# Altium schematic sheet ADC.SchDoc
size 420 x 297 mm
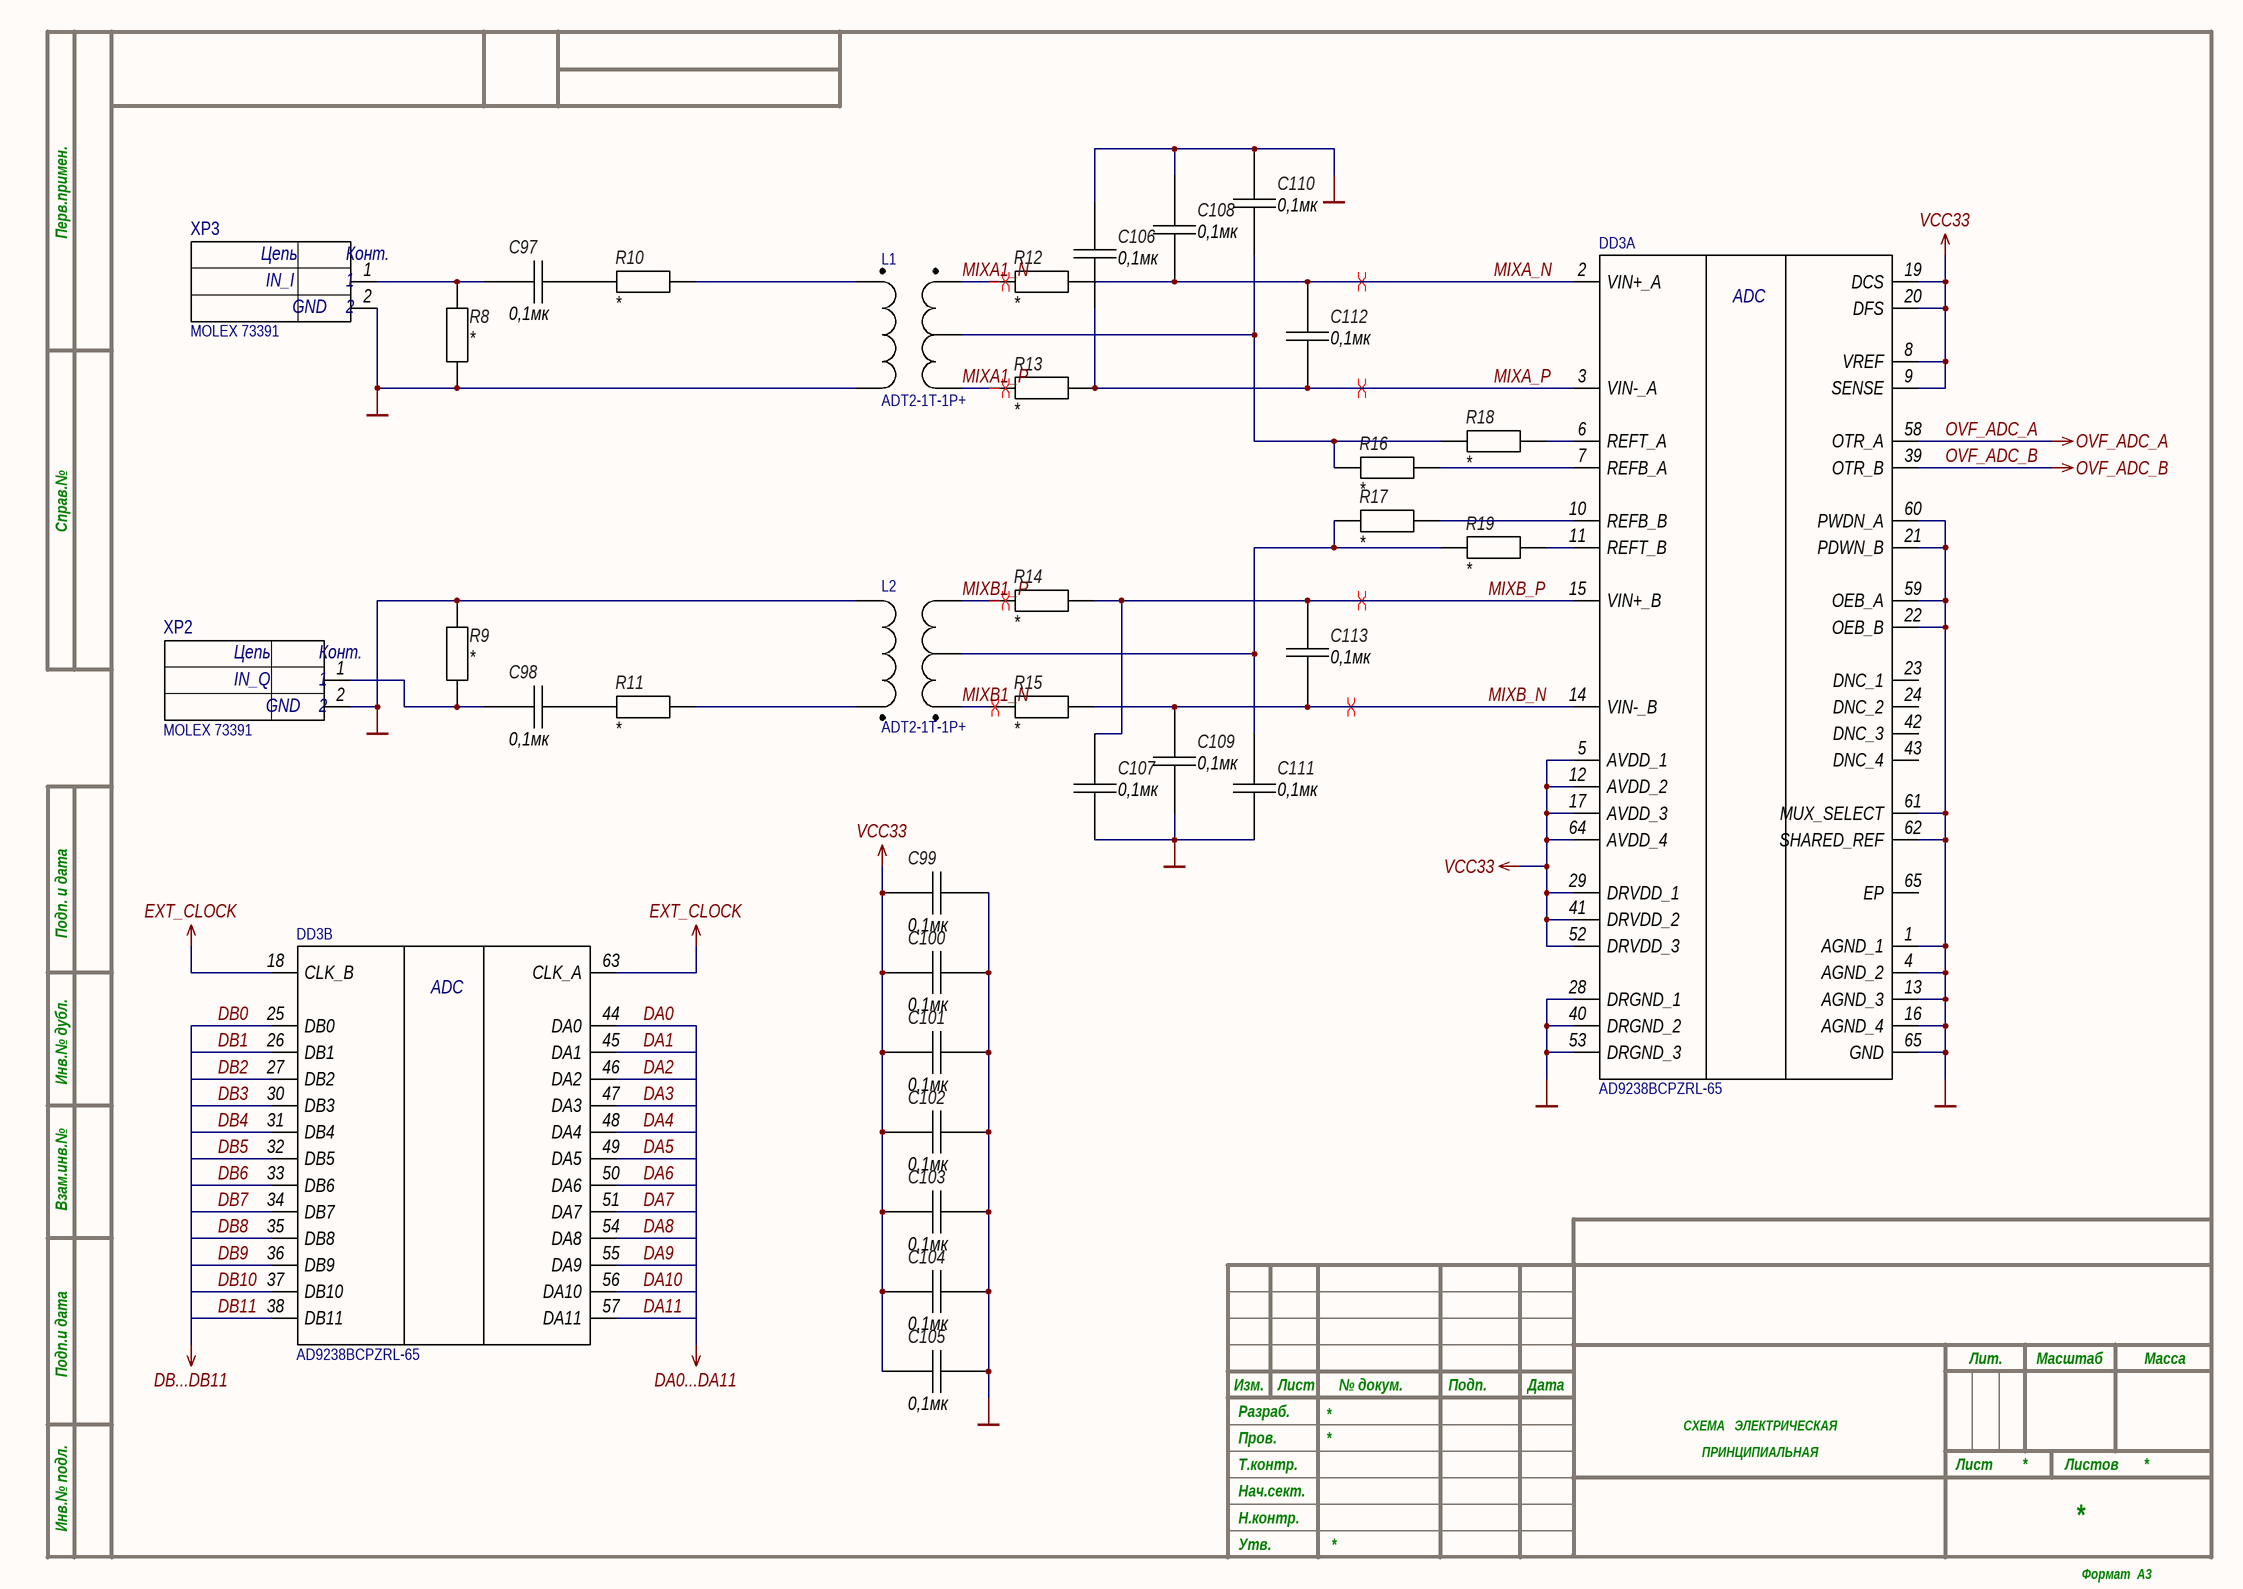
[diagram p0: ADC.SchDoc]

## Parts
C97  0,1мк  [0603]
C98  0,1мк  [0603]
C99  0,1мк  [RESC1005X35N]
C100  0,1мк  [RESC1005X35N]
C101  0,1мк  [RESC1005X35N]
C102  0,1мк  [RESC1005X35N]
C103  0,1мк  [RESC1005X35N]
C104  0,1мк  [RESC1005X35N]
C105  0,1мк  [RESC1005X35N]
C106  0,1мк  [0603]
C107  0,1мк  [0603]
C108  0,1мк  [0603]
C109  0,1мк  [0603]
C110  0,1мк  [0603]
C111  0,1мк  [0603]
C112  0,1мк  [RESC1005X35N]
C113  0,1мк  [RESC1005X35N]
DD3  AD9238BCPZRL-65  [QFN50P900X900X80-65N-D]  (parts A,B of 2)
L1  ADT2-1T-1P+  [ADT1517]
L2  ADT2-1T-1P+  [ADT1517]
R8  *  [RESC3216X75N]
R9  *  [RESC3216X75N]
R10  *  [RESC3216X75N]
R11  *  [RESC3216X75N]
R12  *  [RESC3216X75N]
R13  *  [RESC3216X75N]
R14  *  [RESC3216X75N]
R15  *  [RESC3216X75N]
R16  *  [RESC3216X75N]
R17  *  [RESC3216X75N]
R18  *  [RESC3216X75N]
R19  *  [RESC3216X75N]
XP2  MOLEX 73391  [CONN_73391-0070_MOL]
XP3  MOLEX 73391  [CONN_73391-0070_MOL]

## Nets
EXT_CLOCK: DD3.18(CLK_B) DD3.63(CLK_A)
GND: C99.2 C100.2 C101.2 C102.2 C103.2 C104.2 C105.2 C106.2 C107.2 C108.1 C109.2 C110.1 C111.2 DD3.1(AGND_1) DD3.4(AGND_2) DD3.13(AGND_3) DD3.16(AGND_4) DD3.21(PDWN_B) DD3.22(OEB_B) DD3.28(DRGND_1) DD3.40(DRGND_2) DD3.53(DRGND_3) DD3.59(OEB_A) DD3.60(PWDN_A) DD3.61(MUX_SELECT) DD3.62(SHARED_REF) DD3.65(EP) L1.2 L2.2 R8.1 R9.1 XP2.2 XP3.2
OVF_ADC_A: DD3.58(OTR_A)
OVF_ADC_B: DD3.39(OTR_B)
VCC33: C99.1 C100.1 C101.1 C102.1 C103.1 C104.1 C105.1 DD3.5(AVDD_1) DD3.8(VREF) DD3.9(SENSE) DD3.12(AVDD_2) DD3.17(AVDD_3) DD3.19(DCS) DD3.20(DFS) DD3.29(DRVDD_1) DD3.41(DRVDD_2) DD3.52(DRVDD_3) DD3.64(AVDD_4)
DA0: DD3.44(DA0)
DA1: DD3.45(DA1)
DA2: DD3.46(DA2)
DA3: DD3.47(DA3)
DA4: DD3.48(DA4)
DA5: DD3.49(DA5)
DA6: DD3.50(DA6)
DA7: DD3.51(DA7)
DA8: DD3.54(DA8)
DA9: DD3.55(DA9)
DA10: DD3.56(DA10)
DA11: DD3.57(DA11)
DB0: DD3.25(DB0)
DB1: DD3.26(DB1)
DB2: DD3.27(DB2)
DB3: DD3.30(DB3)
DB4: DD3.31(DB4)
DB5: DD3.32(DB5)
DB6: DD3.33(DB6)
DB7: DD3.34(DB7)
DB8: DD3.35(DB8)
DB9: DD3.36(DB9)
DB10: DD3.37(DB10)
DB11: DD3.38(DB11)
MIXA1_N: L1.6 R12.1
MIXA1_P: L1.4 R13.1
MIXA_N: C108.2 C112.1 DD3.2(VIN+_A) R12.2
MIXA_P: C106.1 C112.2 DD3.3(VIN-_A) R13.2
MIXB1_N: L2.6 R15.1
MIXB1_P: L2.4 R14.1
MIXB_N: C109.1 C113.1 DD3.14(VIN-_B) R15.2
MIXB_P: C107.1 C113.2 DD3.15(VIN+_B) R14.2
NetC97_1: C97.1 R8.2 XP3.1
NetC97_2: C97.2 R10.1
NetC98_1: C98.1 R9.2 XP2.1
NetC98_2: C98.2 R11.1
NetC110_2: C110.2 L1.5 R16.1 R18.1
NetC111_1: C111.1 L2.5 R17.1 R19.1
NetDD3_6: DD3.6(REFT_A) R18.2
NetDD3_7: DD3.7(REFB_A) R16.2
NetDD3_10: DD3.10(REFB_B) R17.2
NetDD3_11: DD3.11(REFT_B) R19.2
NetL1_1: L1.1 R10.2
NetL2_1: L2.1 R11.2

Not connected (* = marked no-connect by the designer): DD3 23(DNC_1) 24(DNC_2) 42(DNC_3) 43(DNC_4)

## Layout directives
differential pair: MIXA1_N, MIXA1_P, MIXA_N, MIXA_P, MIXB1_N, MIXB1_P, MIXB_N, MIXB_P

## Notes on the sheet
- (near XP3) IN_I
- (near XP2) IN_Q
- Labels drawn without touching a wire or pin: DA0...DA11, DB...DB11
- Перв.примен.
- Справ.№
- Подп. и дата
- Инв.№ дубл.
- Взам.инв.№
- Подп.и дата
- Разраб.
- Изм.
- Лист
- № докум.
- Подп.
- Дата
- Лит.
- Масштаб
- Масса
- Т.контр.
- Пров.
- СХЕМА   ЭЛЕКТРИЧЕСКАЯ
- ПРИНЦИПИАЛЬНАЯ
- Листов
- Инв.№ подл.
- Утв.
- Н.контр.
- Нач.сект.
- Формат  A3
- (in symbol SMA_REAL) Цепь; Конт.; GND

## Library data of the parts
C97 C98 C106-C111 = Capacitor_0603: ValueType: Конденсатор; Value: 0,1мк; Tolerance: *; URL: *; Temp: *; Case: *; ValueManufacturer: *; ValueManufacturerPartNumber: *; ValueDescription: *; Dielectric: *; ESR: *; Voltage: *
C99-C105 C112 C113 = Capacitor_0.1u: ValueType: Конденсатор; Value: 0,1мк; Tolerance: *; URL: *; Temp: *; Case: *; ValueManufacturer: *; ValueManufacturerPartNumber: *; ValueDescription: *; Dielectric: *; ESR: *; Voltage: *
DD3 = ADC
L1 L2 = TRANSFORMER
R8-R15 = Resistor: ValueManufacturer: Yageo; ValueManufacturerPartNumber: RC0603JR-07680RL; Tolerance: 5%; Temp: -55*C..+155*C; Power: 0,1 Вт; ValueType: Резистор; Value: *; URL: *; Case: 0603; ValueDescription: *
R16-R19 = Resistor_0402_1k: ValueManufacturer: Yageo; ValueManufacturerPartNumber: RC0603JR-07680RL; Tolerance: 5%; Temp: -55*C..+155*C; Power: 0,1 Вт; ValueType: Резистор; Value: *; URL: *; Case: 0603; ValueDescription: *
XP2 XP3 = SMA_REAL